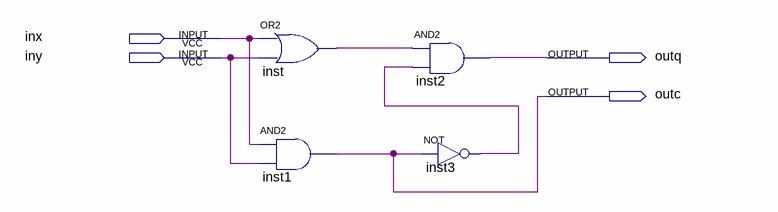
[diagram p0: schematic sheet]
// Quartus schematic SM1.bdf as structural Verilog: 4 symbols, 4 pins
module SM1 (
  input  inx,
  input  iny,
  output outq,
  output outc
);

  wire inst3_out, inst_out;

  or inst (inst_out, inx, iny);
  and inst1 (outc, inx, iny);
  and inst2 (outq, inst_out, inst3_out);
  not inst3 (inst3_out, outc);
endmodule
